# Altium schematic sheet RS485_Port.SchDoc
size A3; SheetNumber: 6; SheetTotal: 9
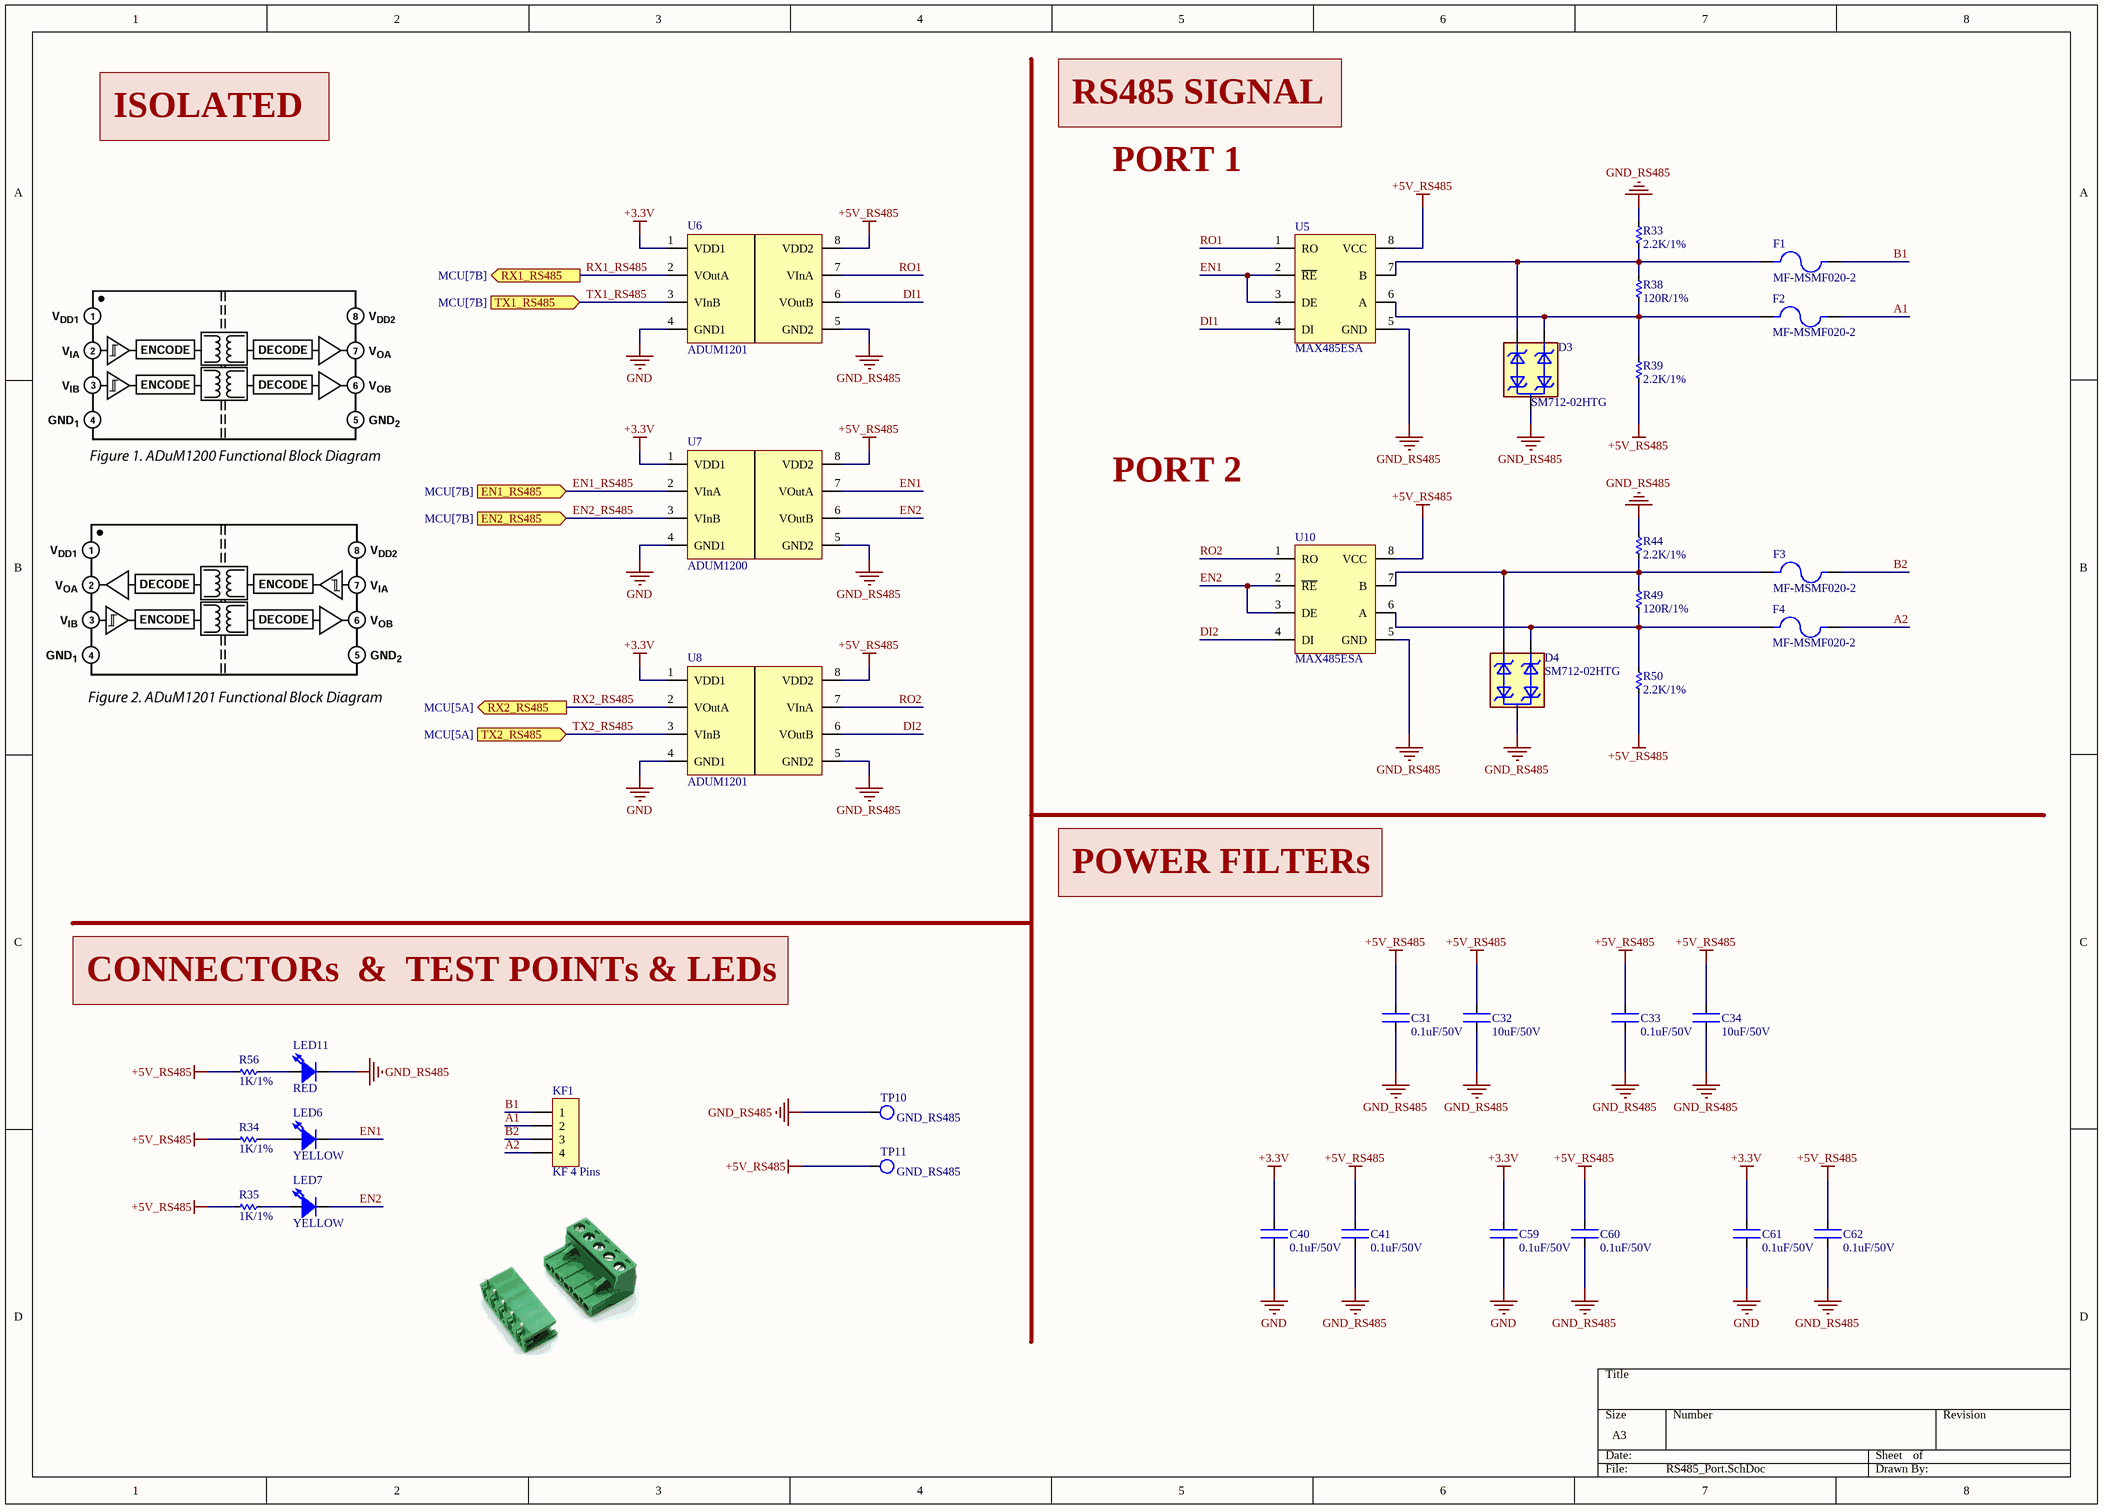
[diagram p0: RS485_Port.SchDoc]

## Parts
C31  0.1uF/50V  [CAP - 0603]
C32  10uF/50V  [CAP - 0603]
C33  0.1uF/50V  [CAP - 0603]
C34  10uF/50V  [CAP - 0603]
C40  0.1uF/50V  [CAP - 0603]
C41  0.1uF/50V  [CAP - 0603]
C59  0.1uF/50V  [CAP - 0603]
C60  0.1uF/50V  [CAP - 0603]
C61  0.1uF/50V  [CAP - 0603]
C62  0.1uF/50V  [CAP - 0603]
D3  SM712-02HTG  [SOT23-3]
D4  SM712-02HTG  [SOT23-3]
F1  MF-MSMF020-2  [Fuse 4.55x3.24 mm]
F2  MF-MSMF020-2  [Fuse 4.55x3.24 mm]
F3  MF-MSMF020-2  [Fuse 4.55x3.24 mm]
F4  MF-MSMF020-2  [Fuse 4.55x3.24 mm]
KF1  KF 4 Pins  [KF_4]
LED6  YELLOW  [YELLOW_LED_0805]
LED7  YELLOW  [YELLOW_LED_0805]
LED11  RED  [RED_LED_0603]
R33  2.2K/1%  [RES - 0603]
R34  1K/1%  [RES - 0603]
R35  1K/1%  [RES - 0603]
R38  120R/1%  [RES - 0603]
R39  2.2K/1%  [RES - 0603]
R44  2.2K/1%  [RES - 0603]
R49  120R/1%  [RES - 0603]
R50  2.2K/1%  [RES - 0603]
R56  1K/1%  [RES - 0603]
TP10  GND_RS485  [Test Point]
TP11  GND_RS485  [Test Point]
U5  MAX485ESA  [SOP_8]
U6  ADUM1201  [SOP_8]
U7  ADUM1200  [SOP_8]
U8  ADUM1201  [SOP_8]
U10  MAX485ESA  [SOP_8]

## Ports
EN1_RS485 (in, see MCU[7B]), EN2_RS485 (in, see MCU[7B]), RX1_RS485 (out, see MCU[7B]), RX2_RS485 (out, see MCU[5A]), TX1_RS485 (in, see MCU[7B]), TX2_RS485 (in, see MCU[5A])

## Nets
+3.3V: C40.1 C59.1 C61.1 U6.1(VDD1) U7.1(VDD1) U8.1(VDD1)
+5V_RS485: C31.1 C32.1 C33.1 C34.1 C41.1 C60.1 C62.1 R34.1 R35.1 R39.1 R50.1 R56.1 TP11.1 U5.8(VCC) U6.8(VDD2) U7.8(VDD2) U8.8(VDD2) U10.8(VCC)
GND: C40.2 C59.2 C61.2 U6.4(GND1) U7.4(GND1) U8.4(GND1)
GND_RS485: C31.2 C32.2 C33.2 C34.2 C41.2 C60.2 C62.2 D3.3 D4.3 LED11.2 R33.2 R44.2 TP10.1 U5.5(GND) U6.5(GND2) U7.5(GND2) U8.5(GND2) U10.5(GND)
A1: F2.2 KF1.2
A2: F4.2 KF1.4
B1: F1.2 KF1.1
B2: F3.2 KF1.3
DI1: U5.4(DI) U6.6(VOutB)
DI2: U8.6(VOutB) U10.4(DI)
EN1: LED6.2 U5.2(~{RE}) U5.3(DE) U7.7(VOutA)
EN1_RS485: U7.2(VInA) ; port EN1_RS485
EN2: LED7.2 U7.6(VOutB) U10.2(~{RE}) U10.3(DE)
EN2_RS485: U7.3(VInB) ; port EN2_RS485
RO1: U5.1(RO) U6.7(VInA)
RO2: U8.7(VInA) U10.1(RO)
RX1_RS485: U6.2(VOutA) ; port RX1_RS485
RX2_RS485: U8.2(VOutA) ; port RX2_RS485
TX1_RS485: U6.3(VInB) ; port TX1_RS485
TX2_RS485: U8.3(VInB) ; port TX2_RS485
NetD3_1: D3.1 F2.1 R38.1 R39.2 U5.6(A)
NetD3_2: D3.2 F1.1 R33.1 R38.2 U5.7(B)
NetD4_1: D4.1 F4.1 R49.1 R50.2 U10.6(A)
NetD4_2: D4.2 F3.1 R44.1 R49.2 U10.7(B)
NetLED6_1: LED6.1 R34.2
NetLED7_1: LED7.1 R35.2
NetLED11_1: LED11.1 R56.2

## Notes on the sheet
- RS485 SIGNAL
- ISOLATED
- PORT 1
- PORT 2
- POWER FILTERs
- CONNECTORs  &  TEST POINTs & LEDs

## Library data of the parts
C31-C34 C40 C41 C59-C62 = CAPACITOR: CAPACITOR SMD - KEMET
D3 D4 = SM712-02HTG: TVS Diode, SM712 Series, 31V Clamp, 600W Peak Pulse, Surface Mount, SOT23-3 | Littelfuse SM712-02HTG
F1-F4 = MF-MSMF020-2: Fuse Resettable 30V/0.2A; Size 4.55 x 3.24mm
KF1 = KF 4 Pins: KF Terminal Block Plug-in
LED6 LED7 LED11 = LED_SMD: LED SMD
R33-R35 R38 R39 R44 R49 R50 R56 = RESISTOR: Resistor SMD - YAGEO
TP10 TP11 = TEST POINT: Supplier Part Number 1: 36-5014-ND; Supplier 1: Digikey
U5 U10 = MAX485ESA: 1/1 Transceiver Half RS422, RS485
U6 U8 = ADUM1201: Dual-Channel Digital Isolators, General Purpose Digital Isolator 2500Vrms 2 Channel 1Mbps 25kV/µs
U7 = ADUM1200: Dual-Channel Digital Isolators, General Purpose Digital Isolator 2500Vrms 2 Channel 1Mbps 25kV/µs